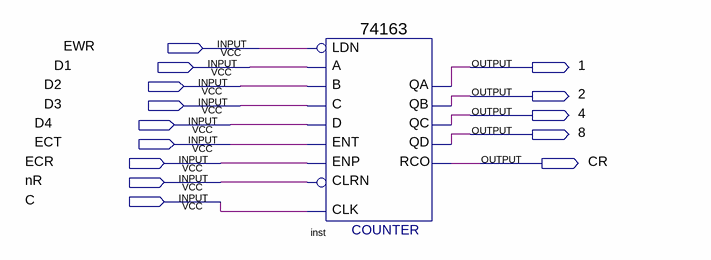
[diagram p0: schematic sheet]
// Quartus schematic kp15533IE18.bdf as structural Verilog: 1 symbols, 14 pins
module kp15533IE18 (
  input  EWR,
  input  D1,
  input  D2,
  input  D3,
  input  D4,
  input  ECT,
  input  ECR,
  input  nR,
  input  C,
  output \1 ,
  output \2 ,
  output \4 ,
  output \8 ,
  output CR
);

  \74163  inst (
    .C(D3), .B(D2), .A(D1), .ENT(ECT), .D(D4), .CLRN(nR), .CLK(C), .ENP(ECR), .LDN(EWR), .QA(\1 ), .QB(\2 ),
    .QC(\4 ), .QD(\8 ), .RCO(CR));
endmodule
